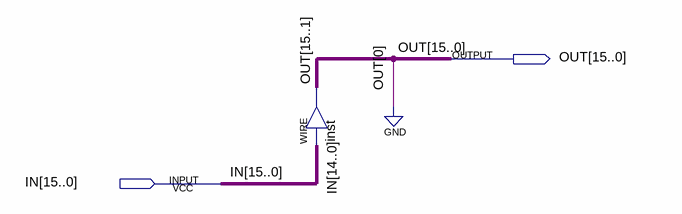
[diagram p0: schematic sheet]
// Quartus schematic SHIFT_1_16BIT.bdf as structural Verilog: 1 symbols, 2 pins
module SHIFT_1_16BIT (
  input  [15:0] IN,
  output [15:0] OUT
);

  assign OUT[15:1] = IN[14:0];  // WIRE inst

  assign OUT[0] = 1'b0;
endmodule
